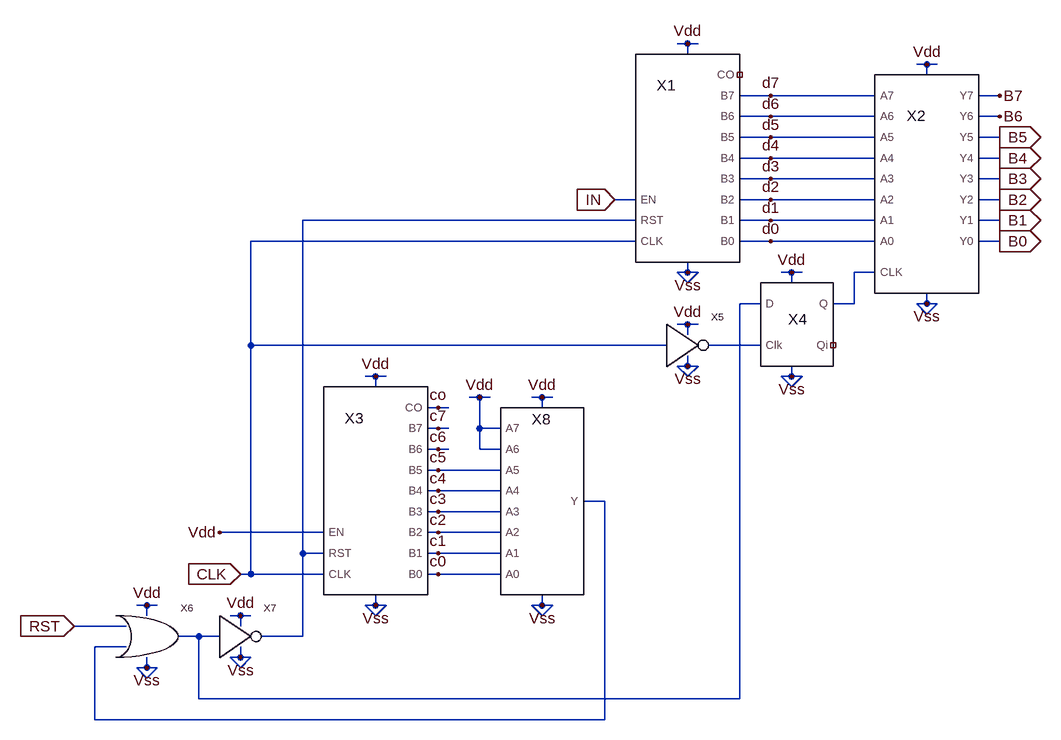
[diagram p0: schematic 6bit_acc_dump.asc]
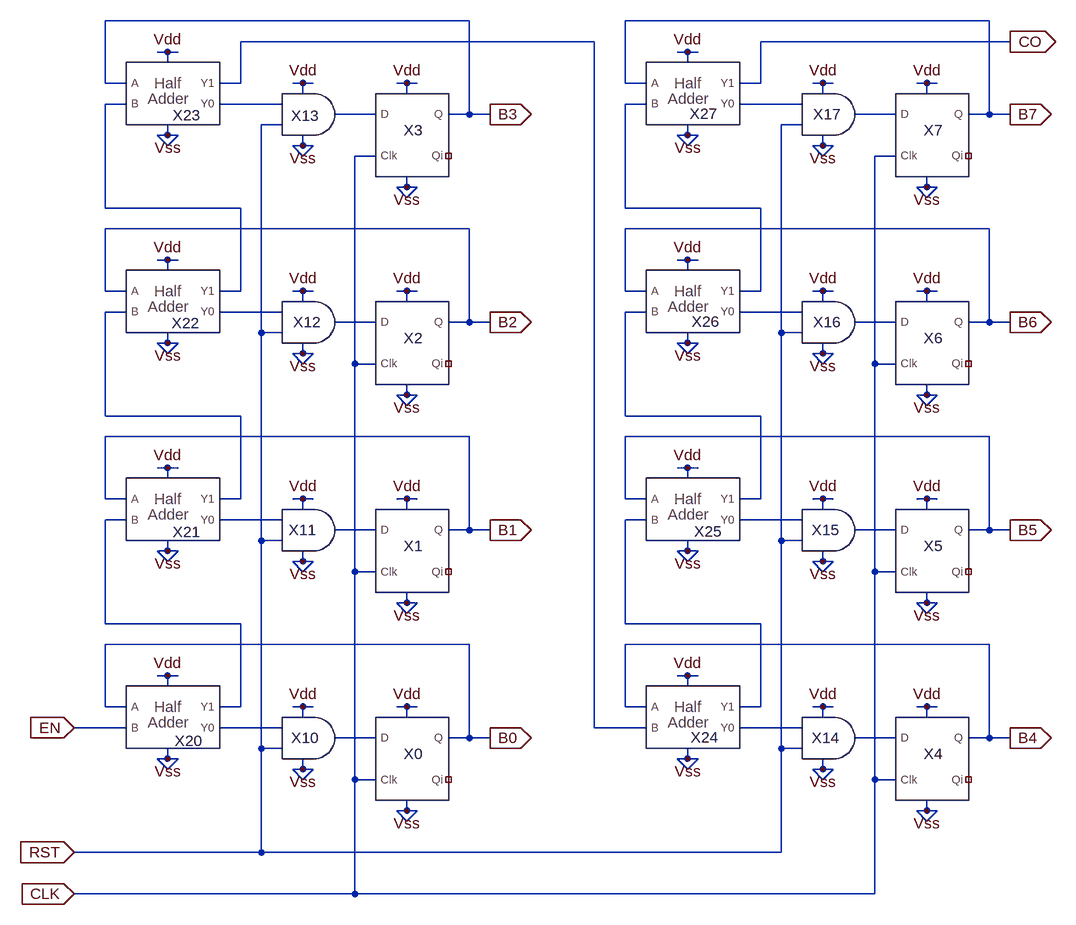
[diagram p1: sub-circuit 8bitcounter.asc]
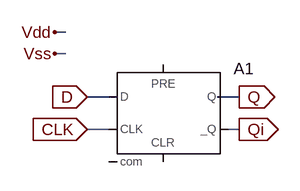
[diagram p2: sub-circuit dff.asc]
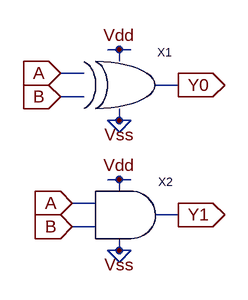
[diagram p3: sub-circuit halfadder.asc]
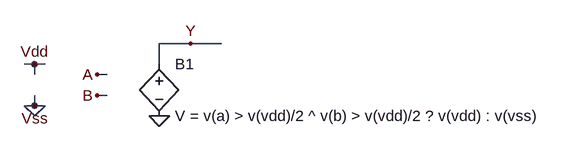
[diagram p4: sub-circuit xor.asc]
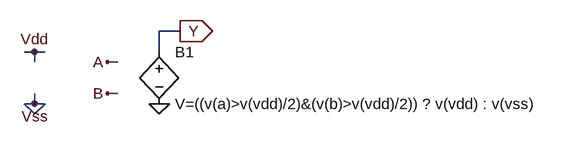
[diagram p5: sub-circuit and.asc]
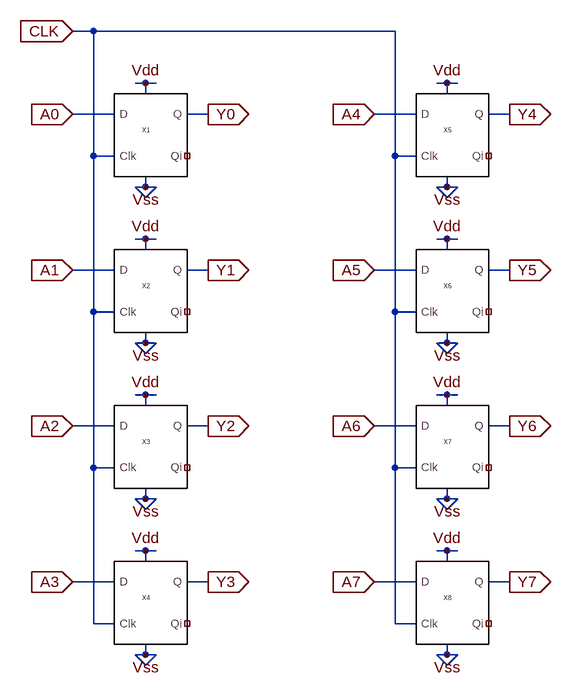
[diagram p6: sub-circuit 8bitreg.asc]
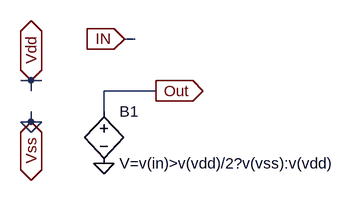
[diagram p7: sub-circuit inv.asc]
6bit_acc_dump.asc, the LTspice schematic file:
Version 4
SHEET 1 1020 1092
WIRE 448 -16 432 -16
WIRE 464 -16 448 -16
WIRE 448 0 448 -16
WIRE 816 16 800 16
WIRE 832 16 816 16
WIRE 816 32 816 16
WIRE 576 64 528 64
WIRE 736 64 576 64
WIRE 928 64 896 64
WIRE 576 96 528 96
WIRE 736 96 576 96
WIRE 928 96 896 96
WIRE 576 128 528 128
WIRE 736 128 576 128
WIRE 928 128 896 128
WIRE 576 160 528 160
WIRE 736 160 576 160
WIRE 928 160 896 160
WIRE 576 192 528 192
WIRE 736 192 576 192
WIRE 928 192 896 192
WIRE 368 224 336 224
WIRE 576 224 528 224
WIRE 736 224 576 224
WIRE 928 224 896 224
WIRE 368 256 -144 256
WIRE 576 256 528 256
WIRE 736 256 576 256
WIRE 928 256 896 256
WIRE 368 288 -224 288
WIRE 576 288 528 288
WIRE 736 288 576 288
WIRE 928 288 896 288
WIRE 448 336 448 320
WIRE 448 336 432 336
WIRE 464 336 448 336
WIRE 608 336 592 336
WIRE 624 336 608 336
WIRE 736 336 704 336
WIRE 448 352 432 336
WIRE 448 352 464 336
WIRE 608 352 608 336
WIRE 560 384 528 384
WIRE 704 384 704 336
WIRE 704 384 672 384
WIRE 816 384 816 368
WIRE 816 384 800 384
WIRE 832 384 816 384
WIRE 816 400 800 384
WIRE 816 400 832 384
WIRE 448 416 432 416
WIRE 464 416 448 416
WIRE 448 432 448 416
WIRE -224 448 -224 288
WIRE 416 448 -224 448
WIRE 560 448 480 448
WIRE 448 480 448 464
WIRE 448 480 432 480
WIRE 464 480 448 480
WIRE -32 496 -48 496
WIRE -16 496 -32 496
WIRE 448 496 432 480
WIRE 448 496 464 480
WIRE 608 496 608 480
WIRE 608 496 592 496
WIRE 624 496 608 496
WIRE -32 512 -32 496
WIRE 608 512 592 496
WIRE 608 512 624 496
WIRE 128 528 112 528
WIRE 144 528 128 528
WIRE 224 528 208 528
WIRE 240 528 224 528
WIRE 64 544 48 544
WIRE 80 544 64 544
WIRE 224 544 224 528
WIRE 64 576 48 576
WIRE 80 576 64 576
WIRE 128 576 128 528
WIRE 160 576 128 576
WIRE 64 608 48 608
WIRE 80 608 64 608
WIRE 128 608 128 576
WIRE 160 608 128 608
WIRE 64 640 48 640
WIRE 160 640 64 640
WIRE 64 672 48 672
WIRE 160 672 64 672
WIRE 320 688 288 688
WIRE 64 704 48 704
WIRE 160 704 64 704
WIRE -112 736 -272 736
WIRE 64 736 48 736
WIRE 160 736 64 736
WIRE -144 768 -144 256
WIRE -112 768 -144 768
WIRE 64 768 48 768
WIRE 160 768 64 768
WIRE -224 800 -224 448
WIRE -224 800 -240 800
WIRE -112 800 -224 800
WIRE 64 800 48 800
WIRE 160 800 64 800
WIRE -384 848 -400 848
WIRE -368 848 -384 848
WIRE -32 848 -32 832
WIRE -32 848 -48 848
WIRE -16 848 -32 848
WIRE 224 848 224 832
WIRE 224 848 208 848
WIRE 240 848 224 848
WIRE -384 864 -384 848
WIRE -240 864 -256 864
WIRE -224 864 -240 864
WIRE -32 864 -48 848
WIRE -32 864 -16 848
WIRE 224 864 208 848
WIRE 224 864 240 848
WIRE -416 880 -496 880
WIRE -240 880 -240 864
WIRE -304 896 -336 896
WIRE -272 896 -304 896
WIRE -144 896 -144 768
WIRE -144 896 -208 896
WIRE -416 912 -464 912
WIRE -240 928 -240 912
WIRE -240 928 -256 928
WIRE -224 928 -240 928
WIRE -384 944 -384 928
WIRE -384 944 -400 944
WIRE -368 944 -384 944
WIRE -240 944 -256 928
WIRE -240 944 -224 928
WIRE -384 960 -400 944
WIRE -384 960 -368 944
WIRE -304 992 -304 896
WIRE 528 992 528 384
WIRE 528 992 -304 992
WIRE -464 1024 -464 912
WIRE 320 1024 320 688
WIRE 320 1024 -464 1024
FLAG 448 -16 Vdd
FLAG 448 336 Vss
FLAG 816 16 Vdd
FLAG 816 384 Vss
FLAG 928 288 B0
IOPIN 928 288 Out
FLAG 928 256 B1
IOPIN 928 256 Out
FLAG 928 224 B2
IOPIN 928 224 Out
FLAG 928 192 B3
IOPIN 928 192 Out
FLAG 928 160 B4
IOPIN 928 160 Out
FLAG 928 128 B5
IOPIN 928 128 Out
FLAG 928 96 B6
FLAG 928 64 B7
FLAG 336 224 IN
IOPIN 336 224 In
FLAG -32 496 Vdd
FLAG -32 848 Vss
FLAG -240 800 CLK
IOPIN -240 800 In
FLAG -272 736 Vdd
FLAG 448 416 Vdd
FLAG 448 480 Vss
FLAG 608 336 Vdd
FLAG 608 496 Vss
FLAG -384 848 Vdd
FLAG -384 944 Vss
FLAG -240 864 Vdd
FLAG -240 928 Vss
FLAG -496 880 RST
IOPIN -496 880 In
FLAG 64 800 c0
FLAG 64 768 c1
FLAG 64 736 c2
FLAG 64 704 c3
FLAG 64 672 c4
FLAG 64 640 c5
FLAG 64 608 c6
FLAG 64 576 c7
FLAG 576 288 d0
FLAG 576 256 d1
FLAG 576 224 d2
FLAG 576 192 d3
FLAG 576 160 d4
FLAG 576 128 d5
FLAG 576 96 d6
FLAG 576 64 d7
FLAG 64 544 co
FLAG 224 528 Vdd
FLAG 224 848 Vss
FLAG 128 528 Vdd
SYMBOL 8bitcounter 448 192 R0
WINDOW 1 -16 16 VLeft 0
WINDOW 0 -48 -144 Left 0
SYMATTR InstName X1
SYMBOL 8bitreg 736 368 R0
SYMATTR InstName X2
SYMBOL 8bitcounter -32 704 R0
WINDOW 1 -16 16 VLeft 0
WINDOW 0 -48 -144 Left 0
SYMATTR InstName X3
SYMBOL dff 560 480 R0
SYMATTR InstName X4
SYMBOL inv 416 480 R0
SYMATTR InstName X5
SYMBOL or -416 896 R0
SYMATTR InstName X6
SYMBOL inv -272 928 R0
SYMATTR InstName X7
SYMBOL and8 224 688 R0
SYMATTR InstName X8

8bitcounter.asc, the sub-circuit schematic file:
Version 4
SHEET 1 1380 680
WIRE 448 -960 -112 -960
WIRE 1248 -960 688 -960
WIRE 640 -928 96 -928
WIRE 1280 -928 896 -928
WIRE -16 -912 -32 -912
WIRE 0 -912 -16 -912
WIRE 784 -912 768 -912
WIRE 800 -912 784 -912
WIRE -16 -896 -16 -912
WIRE 784 -896 784 -912
WIRE -112 -864 -112 -960
WIRE -80 -864 -112 -864
WIRE 96 -864 96 -928
WIRE 96 -864 64 -864
WIRE 192 -864 176 -864
WIRE 208 -864 192 -864
WIRE 352 -864 336 -864
WIRE 368 -864 352 -864
WIRE 688 -864 688 -960
WIRE 720 -864 688 -864
WIRE 896 -864 896 -928
WIRE 896 -864 864 -864
WIRE 992 -864 976 -864
WIRE 1008 -864 992 -864
WIRE 1152 -864 1136 -864
WIRE 1168 -864 1152 -864
WIRE 192 -848 192 -864
WIRE 352 -848 352 -864
WIRE 992 -848 992 -864
WIRE 1152 -848 1152 -864
WIRE -80 -832 -112 -832
WIRE 160 -832 64 -832
WIRE 720 -832 688 -832
WIRE 960 -832 864 -832
WIRE 304 -816 240 -816
WIRE 448 -816 448 -960
WIRE 448 -816 416 -816
WIRE 480 -816 448 -816
WIRE 1104 -816 1040 -816
WIRE 1248 -816 1248 -960
WIRE 1248 -816 1216 -816
WIRE 1280 -816 1248 -816
WIRE 160 -800 128 -800
WIRE 960 -800 928 -800
WIRE -16 -784 -16 -800
WIRE -16 -784 -32 -784
WIRE 0 -784 -16 -784
WIRE 784 -784 784 -800
WIRE 784 -784 768 -784
WIRE 800 -784 784 -784
WIRE -16 -768 -32 -784
WIRE -16 -768 0 -784
WIRE 192 -768 192 -784
WIRE 192 -768 176 -768
WIRE 208 -768 192 -768
WIRE 784 -768 768 -784
WIRE 784 -768 800 -784
WIRE 992 -768 992 -784
WIRE 992 -768 976 -768
WIRE 1008 -768 992 -768
WIRE 192 -752 176 -768
WIRE 192 -752 208 -768
WIRE 304 -752 272 -752
WIRE 992 -752 976 -768
WIRE 992 -752 1008 -768
WIRE 1104 -752 1072 -752
WIRE 352 -704 352 -720
WIRE 352 -704 336 -704
WIRE 368 -704 352 -704
WIRE 1152 -704 1152 -720
WIRE 1152 -704 1136 -704
WIRE 1168 -704 1152 -704
WIRE 352 -688 336 -704
WIRE 352 -688 368 -704
WIRE 1152 -688 1136 -704
WIRE 1152 -688 1168 -704
WIRE -112 -672 -112 -832
WIRE 96 -672 -112 -672
WIRE 688 -672 688 -832
WIRE 896 -672 688 -672
WIRE 448 -640 -112 -640
WIRE 1248 -640 688 -640
WIRE -16 -592 -32 -592
WIRE 0 -592 -16 -592
WIRE 784 -592 768 -592
WIRE 800 -592 784 -592
WIRE -16 -576 -16 -592
WIRE 784 -576 784 -592
WIRE -112 -544 -112 -640
WIRE -80 -544 -112 -544
WIRE 96 -544 96 -672
WIRE 96 -544 64 -544
WIRE 192 -544 176 -544
WIRE 208 -544 192 -544
WIRE 352 -544 336 -544
WIRE 368 -544 352 -544
WIRE 688 -544 688 -640
WIRE 720 -544 688 -544
WIRE 896 -544 896 -672
WIRE 896 -544 864 -544
WIRE 992 -544 976 -544
WIRE 1008 -544 992 -544
WIRE 1152 -544 1136 -544
WIRE 1168 -544 1152 -544
WIRE 192 -528 192 -544
WIRE 352 -528 352 -544
WIRE 992 -528 992 -544
WIRE 1152 -528 1152 -544
WIRE -80 -512 -112 -512
WIRE 160 -512 64 -512
WIRE 720 -512 688 -512
WIRE 960 -512 864 -512
WIRE 304 -496 240 -496
WIRE 448 -496 448 -640
WIRE 448 -496 416 -496
WIRE 480 -496 448 -496
WIRE 1104 -496 1040 -496
WIRE 1248 -496 1248 -640
WIRE 1248 -496 1216 -496
WIRE 1280 -496 1248 -496
WIRE 128 -480 128 -800
WIRE 160 -480 128 -480
WIRE 928 -480 928 -800
WIRE 960 -480 928 -480
WIRE -16 -464 -16 -480
WIRE -16 -464 -32 -464
WIRE 0 -464 -16 -464
WIRE 784 -464 784 -480
WIRE 784 -464 768 -464
WIRE 800 -464 784 -464
WIRE -16 -448 -32 -464
WIRE -16 -448 0 -464
WIRE 192 -448 192 -464
WIRE 192 -448 176 -448
WIRE 208 -448 192 -448
WIRE 784 -448 768 -464
WIRE 784 -448 800 -464
WIRE 992 -448 992 -464
WIRE 992 -448 976 -448
WIRE 1008 -448 992 -448
WIRE 192 -432 176 -448
WIRE 192 -432 208 -448
WIRE 272 -432 272 -752
WIRE 304 -432 272 -432
WIRE 992 -432 976 -448
WIRE 992 -432 1008 -448
WIRE 1072 -432 1072 -752
WIRE 1104 -432 1072 -432
WIRE 352 -384 352 -400
WIRE 352 -384 336 -384
WIRE 368 -384 352 -384
WIRE 1152 -384 1152 -400
WIRE 1152 -384 1136 -384
WIRE 1168 -384 1152 -384
WIRE 352 -368 336 -384
WIRE 352 -368 368 -384
WIRE 1152 -368 1136 -384
WIRE 1152 -368 1168 -384
WIRE -112 -352 -112 -512
WIRE 96 -352 -112 -352
WIRE 688 -352 688 -512
WIRE 896 -352 688 -352
WIRE 448 -320 -112 -320
WIRE 1248 -320 688 -320
WIRE -16 -272 -32 -272
WIRE 0 -272 -16 -272
WIRE 784 -272 768 -272
WIRE 800 -272 784 -272
WIRE -16 -256 -16 -272
WIRE 784 -256 784 -272
WIRE -112 -224 -112 -320
WIRE -80 -224 -112 -224
WIRE 96 -224 96 -352
WIRE 96 -224 64 -224
WIRE 192 -224 176 -224
WIRE 208 -224 192 -224
WIRE 352 -224 336 -224
WIRE 368 -224 352 -224
WIRE 688 -224 688 -320
WIRE 720 -224 688 -224
WIRE 896 -224 896 -352
WIRE 896 -224 864 -224
WIRE 992 -224 976 -224
WIRE 1008 -224 992 -224
WIRE 1152 -224 1136 -224
WIRE 1168 -224 1152 -224
WIRE 192 -208 192 -224
WIRE 352 -208 352 -224
WIRE 992 -208 992 -224
WIRE 1152 -208 1152 -224
WIRE -80 -192 -112 -192
WIRE 160 -192 64 -192
WIRE 720 -192 688 -192
WIRE 960 -192 864 -192
WIRE 304 -176 240 -176
WIRE 448 -176 448 -320
WIRE 448 -176 416 -176
WIRE 480 -176 448 -176
WIRE 1104 -176 1040 -176
WIRE 1248 -176 1248 -320
WIRE 1248 -176 1216 -176
WIRE 1280 -176 1248 -176
WIRE 128 -160 128 -480
WIRE 160 -160 128 -160
WIRE 928 -160 928 -480
WIRE 960 -160 928 -160
WIRE -16 -144 -16 -160
WIRE -16 -144 -32 -144
WIRE 0 -144 -16 -144
WIRE 784 -144 784 -160
WIRE 784 -144 768 -144
WIRE 800 -144 784 -144
WIRE -16 -128 -32 -144
WIRE -16 -128 0 -144
WIRE 192 -128 192 -144
WIRE 192 -128 176 -128
WIRE 208 -128 192 -128
WIRE 784 -128 768 -144
WIRE 784 -128 800 -144
WIRE 992 -128 992 -144
WIRE 992 -128 976 -128
WIRE 1008 -128 992 -128
WIRE 192 -112 176 -128
WIRE 192 -112 208 -128
WIRE 272 -112 272 -432
WIRE 304 -112 272 -112
WIRE 992 -112 976 -128
WIRE 992 -112 1008 -128
WIRE 1072 -112 1072 -432
WIRE 1104 -112 1072 -112
WIRE 352 -64 352 -80
WIRE 352 -64 336 -64
WIRE 368 -64 352 -64
WIRE 1152 -64 1152 -80
WIRE 1152 -64 1136 -64
WIRE 1168 -64 1152 -64
WIRE 352 -48 336 -64
WIRE 352 -48 368 -64
WIRE 1152 -48 1136 -64
WIRE 1152 -48 1168 -64
WIRE -112 -32 -112 -192
WIRE 96 -32 -112 -32
WIRE 688 -32 688 -192
WIRE 896 -32 688 -32
WIRE 448 0 -112 0
WIRE 1248 0 688 0
WIRE -16 48 -32 48
WIRE 0 48 -16 48
WIRE 784 48 768 48
WIRE 800 48 784 48
WIRE -16 64 -16 48
WIRE 784 64 784 48
WIRE -112 96 -112 0
WIRE -80 96 -112 96
WIRE 96 96 96 -32
WIRE 96 96 64 96
WIRE 192 96 176 96
WIRE 208 96 192 96
WIRE 352 96 336 96
WIRE 368 96 352 96
WIRE 688 96 688 0
WIRE 720 96 688 96
WIRE 896 96 896 -32
WIRE 896 96 864 96
WIRE 992 96 976 96
WIRE 1008 96 992 96
WIRE 1152 96 1136 96
WIRE 1168 96 1152 96
WIRE 192 112 192 96
WIRE 352 112 352 96
WIRE 992 112 992 96
WIRE 1152 112 1152 96
WIRE -80 128 -160 128
WIRE 160 128 64 128
WIRE 640 128 640 -928
WIRE 720 128 640 128
WIRE 960 128 864 128
WIRE 304 144 240 144
WIRE 448 144 448 0
WIRE 448 144 416 144
WIRE 480 144 448 144
WIRE 1104 144 1040 144
WIRE 1248 144 1248 0
WIRE 1248 144 1216 144
WIRE 1280 144 1248 144
WIRE 128 160 128 -160
WIRE 160 160 128 160
WIRE 928 160 928 -160
WIRE 960 160 928 160
WIRE -16 176 -16 160
WIRE -16 176 -32 176
WIRE 0 176 -16 176
WIRE 784 176 784 160
WIRE 784 176 768 176
WIRE 800 176 784 176
WIRE -16 192 -32 176
WIRE -16 192 0 176
WIRE 192 192 192 176
WIRE 192 192 176 192
WIRE 208 192 192 192
WIRE 784 192 768 176
WIRE 784 192 800 176
WIRE 992 192 992 176
WIRE 992 192 976 192
WIRE 1008 192 992 192
WIRE 192 208 176 192
WIRE 192 208 208 192
WIRE 272 208 272 -112
WIRE 304 208 272 208
WIRE 992 208 976 192
WIRE 992 208 1008 192
WIRE 1072 208 1072 -112
WIRE 1104 208 1072 208
WIRE 352 256 352 240
WIRE 352 256 336 256
WIRE 368 256 352 256
WIRE 1152 256 1152 240
WIRE 1152 256 1136 256
WIRE 1168 256 1152 256
WIRE 352 272 336 256
WIRE 352 272 368 256
WIRE 1152 272 1136 256
WIRE 1152 272 1168 256
WIRE 128 320 128 160
WIRE 128 320 -160 320
WIRE 928 320 928 160
WIRE 928 320 128 320
WIRE 272 384 272 208
WIRE 272 384 -160 384
WIRE 1072 384 1072 208
WIRE 1072 384 272 384
FLAG 352 96 Vdd
FLAG 352 256 Vss
FLAG 192 96 Vdd
FLAG -16 48 Vdd
FLAG 192 192 Vss
FLAG -16 176 Vss
FLAG 480 144 B0
IOPIN 480 144 Out
FLAG 352 -224 Vdd
FLAG 352 -64 Vss
FLAG 192 -224 Vdd
FLAG -16 -272 Vdd
FLAG 192 -128 Vss
FLAG -16 -144 Vss
FLAG 480 -176 B1
IOPIN 480 -176 Out
FLAG 352 -544 Vdd
FLAG 352 -384 Vss
FLAG 192 -544 Vdd
FLAG -16 -592 Vdd
FLAG 192 -448 Vss
FLAG -16 -464 Vss
FLAG 480 -496 B2
IOPIN 480 -496 Out
FLAG 352 -864 Vdd
FLAG 352 -704 Vss
FLAG 192 -864 Vdd
FLAG -16 -912 Vdd
FLAG 192 -768 Vss
FLAG -16 -784 Vss
FLAG 480 -816 B3
IOPIN 480 -816 Out
FLAG -160 128 EN
IOPIN -160 128 In
FLAG -160 320 RST
IOPIN -160 320 In
FLAG -160 384 CLK
IOPIN -160 384 In
FLAG 1152 96 Vdd
FLAG 1152 256 Vss
FLAG 992 96 Vdd
FLAG 784 48 Vdd
FLAG 992 192 Vss
FLAG 784 176 Vss
FLAG 1280 144 B4
IOPIN 1280 144 Out
FLAG 1152 -224 Vdd
FLAG 1152 -64 Vss
FLAG 992 -224 Vdd
FLAG 784 -272 Vdd
FLAG 992 -128 Vss
FLAG 784 -144 Vss
FLAG 1280 -176 B5
IOPIN 1280 -176 Out
FLAG 1152 -544 Vdd
FLAG 1152 -384 Vss
FLAG 992 -544 Vdd
FLAG 784 -592 Vdd
FLAG 992 -448 Vss
FLAG 784 -464 Vss
FLAG 1280 -496 B6
IOPIN 1280 -496 Out
FLAG 1152 -864 Vdd
FLAG 1152 -704 Vss
FLAG 992 -864 Vdd
FLAG 784 -912 Vdd
FLAG 992 -768 Vss
FLAG 784 -784 Vss
FLAG 1280 -816 B7
IOPIN 1280 -816 Out
FLAG 1280 -928 CO
IOPIN 1280 -928 Out
SYMBOL dff 304 240 R0
SYMATTR InstName X0
SYMBOL halfadder -80 160 R0
WINDOW 0 75 -12 Left 0
SYMATTR InstName X20
SYMBOL and 160 144 R0
WINDOW 0 14 0 Left 0
SYMATTR InstName X10
SYMBOL dff 304 -80 R0
SYMATTR InstName X1
SYMBOL halfadder -80 -160 R0
WINDOW 0 72 -13 Left 0
SYMATTR InstName X21
SYMBOL and 160 -176 R0
WINDOW 0 10 0 Left 0
SYMATTR InstName X11
SYMBOL dff 304 -400 R0
SYMATTR InstName X2
SYMBOL halfadder -80 -480 R0
WINDOW 0 70 -15 Left 0
SYMATTR InstName X22
SYMBOL and 160 -496 R0
WINDOW 0 17 0 Left 0
SYMATTR InstName X12
SYMBOL dff 304 -720 R0
SYMATTR InstName X3
SYMBOL halfadder -80 -800 R0
WINDOW 0 72 -15 Left 0
SYMATTR InstName X23
SYMBOL and 160 -816 R0
WINDOW 0 14 2 Left 0
SYMATTR InstName X13
SYMBOL dff 1104 240 R0
SYMATTR InstName X4
SYMBOL halfadder 720 160 R0
WINDOW 0 69 -17 Left 0
SYMATTR InstName X24
SYMBOL and 960 144 R0
WINDOW 0 15 0 Left 0
SYMATTR InstName X14
SYMBOL dff 1104 -80 R0
SYMATTR InstName X5
SYMBOL halfadder 720 -160 R0
WINDOW 0 74 -14 Left 0
SYMATTR InstName X25
SYMBOL and 960 -176 R0
WINDOW 0 15 0 Left 0
SYMATTR InstName X15
SYMBOL dff 1104 -400 R0
SYMATTR InstName X6
SYMBOL halfadder 720 -480 R0
WINDOW 0 70 -17 Left 0
SYMATTR InstName X26
SYMBOL and 960 -496 R0
WINDOW 0 17 0 Left 0
SYMATTR InstName X16
SYMBOL dff 1104 -720 R0
SYMATTR InstName X7
SYMBOL halfadder 720 -800 R0
WINDOW 0 67 -17 Left 0
SYMATTR InstName X27
SYMBOL and 960 -816 R0
WINDOW 0 17 0 Left 0
SYMATTR InstName X17

dff.asc, the sub-circuit schematic file:
Version 4
SHEET 1 880 680
WIRE 64 32 48 32
WIRE 64 64 48 64
WIRE 128 128 96 128
WIRE 320 128 288 128
WIRE 128 176 96 176
WIRE 320 176 304 176
FLAG 96 128 D
IOPIN 96 128 In
FLAG 96 176 CLK
IOPIN 96 176 In
FLAG 320 128 Q
IOPIN 320 128 Out
FLAG 320 176 Qi
IOPIN 320 176 Out
FLAG 48 32 Vdd
FLAG 48 64 Vss
SYMBOL Digital\\dflop 208 80 R0
SYMATTR InstName A1
SYMATTR SpiceLine vhigh=5 tau=1n

halfadder.asc, the sub-circuit schematic file:
Version 4
SHEET 1 880 680
WIRE 96 240 80 240
WIRE 112 240 96 240
WIRE 96 256 96 240
WIRE 48 272 16 272
WIRE 176 288 144 288
WIRE 48 304 16 304
WIRE 96 336 96 320
WIRE 96 336 80 336
WIRE 112 336 96 336
WIRE 96 352 80 336
WIRE 96 352 112 336
WIRE 96 416 80 416
WIRE 112 416 96 416
WIRE 96 432 96 416
WIRE 64 448 32 448
WIRE 176 464 144 464
WIRE 64 480 32 480
WIRE 96 512 96 496
WIRE 96 512 80 512
WIRE 112 512 96 512
WIRE 96 528 80 512
WIRE 96 528 112 512
FLAG 16 272 A
IOPIN 16 272 In
FLAG 16 304 B
IOPIN 16 304 In
FLAG 176 288 Y0
IOPIN 176 288 Out
FLAG 96 240 Vdd
FLAG 96 336 Vss
FLAG 96 416 Vdd
FLAG 96 512 Vss
FLAG 32 448 A
IOPIN 32 448 In
FLAG 32 480 B
IOPIN 32 480 In
FLAG 176 464 Y1
IOPIN 176 464 Out
SYMBOL xor 48 288 R0
SYMATTR InstName X1
SYMBOL and 64 464 R0
SYMATTR InstName X2

xor.asc, the sub-circuit schematic file:
Version 4
SHEET 1 1264 952
WIRE 592 448 544 448
WIRE 640 448 592 448
WIRE 352 480 336 480
WIRE 368 480 352 480
WIRE 544 480 544 448
WIRE 352 496 352 480
WIRE 464 496 448 496
WIRE 464 528 448 528
WIRE 352 544 352 528
WIRE 352 544 336 544
WIRE 368 544 352 544
WIRE 352 560 336 544
WIRE 352 560 368 544
FLAG 448 496 A
FLAG 448 528 B
FLAG 352 480 Vdd
FLAG 352 544 Vss
FLAG 544 560 0
FLAG 592 448 Y
SYMBOL bv 544 464 R0
SYMATTR InstName B1
SYMATTR Value V = v(a) > v(vdd)/2 ^ v(b) > v(vdd)/2 ? v(vdd) : v(vss)

and.asc, the sub-circuit schematic file:
Version 4
SHEET 1 1192 680
WIRE 560 80 528 80
WIRE 336 112 320 112
WIRE 352 112 336 112
WIRE 528 112 528 80
WIRE 336 128 336 112
WIRE 464 128 448 128
WIRE 464 176 448 176
WIRE 336 192 336 176
WIRE 336 192 320 192
WIRE 352 192 336 192
WIRE 336 208 320 192
WIRE 336 208 352 192
FLAG 448 128 A
FLAG 448 176 B
FLAG 336 112 Vdd
FLAG 560 80 Y
IOPIN 560 80 Out
FLAG 336 192 Vss
FLAG 528 192 0
SYMBOL bv 528 96 R0
SYMATTR InstName B1
SYMATTR Value V=((v(a)>v(vdd)/2)&(v(b)>v(vdd)/2)) ? v(vdd) : v(vss)

8bitreg.asc, the sub-circuit schematic file:
Version 4
SHEET 1 880 1012
WIRE -192 -224 -224 -224
WIRE 272 -224 -192 -224
WIRE -112 -144 -128 -144
WIRE -96 -144 -112 -144
WIRE 352 -144 336 -144
WIRE 368 -144 352 -144
WIRE -112 -128 -112 -144
WIRE 352 -128 352 -144
WIRE -160 -96 -224 -96
WIRE -16 -96 -48 -96
WIRE 304 -96 240 -96
WIRE 448 -96 416 -96
WIRE -192 -32 -192 -224
WIRE -160 -32 -192 -32
WIRE 272 -32 272 -224
WIRE 304 -32 272 -32
WIRE -112 16 -112 0
WIRE -112 16 -128 16
WIRE -96 16 -112 16
WIRE 352 16 352 0
WIRE 352 16 336 16
WIRE 368 16 352 16
WIRE -112 32 -128 16
WIRE -112 32 -96 16
WIRE 352 32 336 16
WIRE 352 32 368 16
WIRE -112 96 -128 96
WIRE -96 96 -112 96
WIRE 352 96 336 96
WIRE 368 96 352 96
WIRE -112 112 -112 96
WIRE 352 112 352 96
WIRE -160 144 -224 144
WIRE -16 144 -48 144
WIRE 304 144 240 144
WIRE 448 144 416 144
WIRE -192 208 -192 -32
WIRE -160 208 -192 208
WIRE 272 208 272 -32
WIRE 304 208 272 208
WIRE -112 256 -112 240
WIRE -112 256 -128 256
WIRE -96 256 -112 256
WIRE 352 256 352 240
WIRE 352 256 336 256
WIRE 368 256 352 256
WIRE -112 272 -128 256
WIRE -112 272 -96 256
WIRE 352 272 336 256
WIRE 352 272 368 256
WIRE -112 336 -128 336
WIRE -96 336 -112 336
WIRE 352 336 336 336
WIRE 368 336 352 336
WIRE -112 352 -112 336
WIRE 352 352 352 336
WIRE -160 384 -224 384
WIRE -16 384 -48 384
WIRE 304 384 240 384
WIRE 448 384 416 384
WIRE -192 448 -192 208
WIRE -160 448 -192 448
WIRE 272 448 272 208
WIRE 304 448 272 448
WIRE -112 496 -112 480
WIRE -112 496 -128 496
WIRE -96 496 -112 496
WIRE 352 496 352 480
WIRE 352 496 336 496
WIRE 368 496 352 496
WIRE -112 512 -128 496
WIRE -112 512 -96 496
WIRE 352 512 336 496
WIRE 352 512 368 496
WIRE -112 576 -128 576
WIRE -96 576 -112 576
WIRE 352 576 336 576
WIRE 368 576 352 576
WIRE -112 592 -112 576
WIRE 352 592 352 576
WIRE -160 624 -224 624
WIRE -16 624 -48 624
WIRE 304 624 240 624
WIRE 448 624 416 624
WIRE -192 688 -192 448
WIRE -160 688 -192 688
WIRE 272 688 272 448
WIRE 304 688 272 688
WIRE -112 736 -112 720
WIRE -112 736 -128 736
WIRE -96 736 -112 736
WIRE 352 736 352 720
WIRE 352 736 336 736
WIRE 368 736 352 736
WIRE -112 752 -128 736
WIRE -112 752 -96 736
WIRE 352 752 336 736
WIRE 352 752 368 736
FLAG -112 -144 Vdd
FLAG -112 16 Vss
FLAG -224 -96 A0
IOPIN -224 -96 In
FLAG -16 -96 Y0
IOPIN -16 -96 Out
FLAG -112 96 Vdd
FLAG -112 256 Vss
FLAG -224 144 A1
IOPIN -224 144 In
FLAG -16 144 Y1
IOPIN -16 144 Out
FLAG -112 336 Vdd
FLAG -112 496 Vss
FLAG -224 384 A2
IOPIN -224 384 In
FLAG -16 384 Y2
IOPIN -16 384 Out
FLAG -112 576 Vdd
FLAG -112 736 Vss
FLAG -224 624 A3
IOPIN -224 624 In
FLAG -16 624 Y3
IOPIN -16 624 Out
FLAG -224 -224 CLK
IOPIN -224 -224 In
FLAG 352 -144 Vdd
FLAG 352 16 Vss
FLAG 240 -96 A4
IOPIN 240 -96 In
FLAG 448 -96 Y4
IOPIN 448 -96 Out
FLAG 352 96 Vdd
FLAG 352 256 Vss
FLAG 240 144 A5
IOPIN 240 144 In
FLAG 448 144 Y5
IOPIN 448 144 Out
FLAG 352 336 Vdd
FLAG 352 496 Vss
FLAG 240 384 A6
IOPIN 240 384 In
FLAG 448 384 Y6
IOPIN 448 384 Out
FLAG 352 576 Vdd
FLAG 352 736 Vss
FLAG 240 624 A7
IOPIN 240 624 In
FLAG 448 624 Y7
IOPIN 448 624 Out
SYMBOL dff -160 0 R0
SYMATTR InstName X1
SYMBOL dff -160 240 R0
SYMATTR InstName X2
SYMBOL dff -160 480 R0
SYMATTR InstName X3
SYMBOL dff -160 720 R0
SYMATTR InstName X4
SYMBOL dff 304 0 R0
SYMATTR InstName X5
SYMBOL dff 304 240 R0
SYMATTR InstName X6
SYMBOL dff 304 480 R0
SYMATTR InstName X7
SYMBOL dff 304 720 R0
SYMATTR InstName X8

inv.asc, the sub-circuit schematic file:
Version 4
SHEET 1 6308 700
WIRE 2144 -304 2128 -304
WIRE 1984 -240 1968 -240
WIRE 2000 -240 1984 -240
WIRE 1984 -224 1984 -240
WIRE 2176 -224 2096 -224
WIRE 2096 -192 2096 -224
WIRE 1984 -176 1984 -192
WIRE 1984 -176 1968 -176
WIRE 2000 -176 1984 -176
WIRE 1984 -160 1968 -176
WIRE 1984 -160 2000 -176
FLAG 1984 -240 Vdd
IOPIN 1984 -240 BiDir
FLAG 2176 -224 Out
IOPIN 2176 -224 Out
FLAG 1984 -176 Vss
IOPIN 1984 -176 BiDir
FLAG 2128 -304 IN
IOPIN 2128 -304 In
FLAG 2096 -112 0
SYMBOL bv 2096 -208 R0
SYMATTR InstName B1
SYMATTR Value V=v(in)>v(vdd)/2?v(vss):v(vdd)

or.asc, the sub-circuit schematic file:
Version 4
SHEET 1 1284 680
WIRE 656 0 640 0
WIRE 656 32 640 32
WIRE 656 112 624 112
WIRE 496 144 480 144
WIRE 512 144 496 144
WIRE 624 144 624 112
WIRE 496 160 496 144
WIRE 496 192 496 176
WIRE 496 192 480 192
WIRE 512 192 496 192
WIRE 496 208 480 192
WIRE 496 208 512 192
FLAG 656 112 Y
IOPIN 656 112 Out
FLAG 624 224 0
FLAG 640 0 A
IOPIN 640 0 In
FLAG 640 32 B
IOPIN 640 32 In
FLAG 496 144 Vdd
FLAG 496 192 Vss
SYMBOL bv 624 128 R0
SYMATTR InstName B1
SYMATTR Value V=v(a)>v(vdd)/2 | v(b)>v(vdd)/2 ? v(vdd) : v(vss)

and8.asc, the sub-circuit schematic file:
Version 4
SHEET 1 880 700
WIRE 144 80 128 80
WIRE 160 80 144 80
WIRE 144 96 144 80
WIRE 112 112 80 112
WIRE 224 128 192 128
WIRE 112 144 80 144
WIRE 288 160 272 160
WIRE 304 160 288 160
WIRE 144 176 144 160
WIRE 144 176 128 176
WIRE 160 176 144 176
WIRE 288 176 288 160
WIRE 144 192 128 176
WIRE 144 192 160 176
WIRE 224 192 224 128
WIRE 256 192 224 192
WIRE 368 208 336 208
WIRE 256 224 224 224
WIRE 144 240 128 240
WIRE 160 240 144 240
WIRE 144 256 144 240
WIRE 288 256 288 240
WIRE 288 256 272 256
WIRE 304 256 288 256
WIRE 112 272 80 272
WIRE 288 272 272 256
WIRE 288 272 304 256
WIRE 224 288 224 224
WIRE 224 288 192 288
WIRE 112 304 80 304
WIRE 432 320 416 320
WIRE 448 320 432 320
WIRE 144 336 144 320
WIRE 144 336 128 336
WIRE 160 336 144 336
WIRE 432 336 432 320
WIRE 144 352 128 336
WIRE 144 352 160 336
WIRE 368 352 368 208
WIRE 400 352 368 352
WIRE 512 368 480 368
WIRE 400 384 368 384
WIRE 144 400 128 400
WIRE 160 400 144 400
WIRE 144 416 144 400
WIRE 432 416 432 400
WIRE 432 416 416 416
WIRE 448 416 432 416
WIRE 112 432 80 432
WIRE 432 432 416 416
WIRE 432 432 448 416
WIRE 224 448 192 448
WIRE 112 464 80 464
WIRE 288 480 272 480
WIRE 304 480 288 480
WIRE 144 496 144 480
WIRE 144 496 128 496
WIRE 160 496 144 496
WIRE 288 496 288 480
WIRE 144 512 128 496
WIRE 144 512 160 496
WIRE 224 512 224 448
WIRE 256 512 224 512
WIRE 368 528 368 384
WIRE 368 528 336 528
WIRE 256 544 224 544
WIRE 144 560 128 560
WIRE 160 560 144 560
WIRE 144 576 144 560
WIRE 288 576 288 560
WIRE 288 576 272 576
WIRE 304 576 288 576
WIRE 112 592 80 592
WIRE 288 592 272 576
WIRE 288 592 304 576
WIRE 224 608 224 544
WIRE 224 608 192 608
WIRE 112 624 80 624
WIRE 144 656 144 640
WIRE 144 656 128 656
WIRE 160 656 144 656
WIRE 144 672 128 656
WIRE 144 672 160 656
FLAG 144 80 Vdd
FLAG 144 176 Vss
FLAG 144 240 Vdd
FLAG 144 336 Vss
FLAG 144 400 Vdd
FLAG 144 496 Vss
FLAG 144 560 Vdd
FLAG 144 656 Vss
FLAG 288 160 Vdd
FLAG 288 256 Vss
FLAG 288 480 Vdd
FLAG 288 576 Vss
FLAG 432 320 Vdd
FLAG 432 416 Vss
FLAG 80 624 A0
IOPIN 80 624 In
FLAG 80 592 A1
IOPIN 80 592 In
FLAG 80 464 A2
IOPIN 80 464 In
FLAG 80 432 A3
IOPIN 80 432 In
FLAG 80 304 A4
IOPIN 80 304 In
FLAG 80 272 A5
IOPIN 80 272 In
FLAG 80 144 A6
IOPIN 80 144 In
FLAG 80 112 A7
IOPIN 80 112 In
FLAG 512 368 Y
IOPIN 512 368 Out
SYMBOL and 112 128 R0
SYMATTR InstName X1
SYMBOL and 112 288 R0
SYMATTR InstName X2
SYMBOL and 112 448 R0
SYMATTR InstName X3
SYMBOL and 112 608 R0
SYMATTR InstName X4
SYMBOL and 256 208 R0
SYMATTR InstName X5
SYMBOL and 256 528 R0
SYMATTR InstName X6
SYMBOL and 400 368 R0
SYMATTR InstName X7

The netlist it stands for:
* 6bit_acc_dump.asc
XX1 Vdd Vss IN CLK N001 d0 d1 d2 d3 d4 d5 d6 d7 NC_01 8bitcounter
XX2 Vdd Vss N002 d0 d1 d2 d3 d4 d5 d6 d7 B0 B1 B2 B3 B4 B5 B6 B7 8bitreg
XX3 Vdd Vss Vdd CLK N001 c0 c1 c2 c3 c4 c5 c6 c7 co 8bitcounter
XX4 N003 N004 N002 NC_02 Vdd Vss dff
XX5 Vdd Vss CLK N004 inv
XX6 RST N005 N003 Vdd Vss or
XX7 Vdd Vss N003 N001 inv
XX8 Vdd Vss c0 c1 c2 c3 c4 c5 Vdd Vdd N005 and8

* block symbol definitions
.subckt 8bitcounter Vdd Vss EN CLK RST B0 B1 B2 B3 B4 B5 B6 B7 CO
XX0 N022 CLK B0 NC_01 Vdd Vss dff
XX20 B0 EN N020 N014 Vdd Vss halfadder
XX10 N020 RST N022 Vdd Vss and
XX1 N018 CLK B1 NC_02 Vdd Vss dff
XX21 B1 N014 N015 N008 Vdd Vss halfadder
XX11 N015 RST N018 Vdd Vss and
XX2 N012 CLK B2 NC_03 Vdd Vss dff
XX22 B2 N008 N009 N002 Vdd Vss halfadder
XX12 N009 RST N012 Vdd Vss and
XX3 N006 CLK B3 NC_04 Vdd Vss dff
XX23 B3 N002 N003 N001 Vdd Vss halfadder
XX13 N003 RST N006 Vdd Vss and
XX4 N023 CLK B4 NC_05 Vdd Vss dff
XX24 B4 N001 N021 N016 Vdd Vss halfadder
XX14 N021 RST N023 Vdd Vss and
XX5 N019 CLK B5 NC_06 Vdd Vss dff
XX25 B5 N016 N017 N010 Vdd Vss halfadder
XX15 N017 RST N019 Vdd Vss and
XX6 N013 CLK B6 NC_07 Vdd Vss dff
XX26 B6 N010 N011 N004 Vdd Vss halfadder
XX16 N011 RST N013 Vdd Vss and
XX7 N007 CLK B7 NC_08 Vdd Vss dff
XX27 B7 N004 N005 CO Vdd Vss halfadder
XX17 N005 RST N007 Vdd Vss and
.ends 8bitcounter

.subckt dff D Clk Q Qi VDD Vss
A1 D 0 CLK 0 0 Qi Q 0 DFLOP vhigh=5 tau=1n
.ends dff

.subckt halfadder A B Y0 Y1 Vdd Vss
XX1 A B Y0 Vdd Vss xor
XX2 A B Y1 Vdd Vss and
.ends halfadder

.subckt xor A B Y Vdd Vss
B1 Y 0 V = v(a) > v(vdd)/2 ^ v(b) > v(vdd)/2 ? v(vdd) : v(vss)
.ends xor

.subckt and A B Y Vdd Vss
B1 Y 0 V=((v(a)>v(vdd)/2)&(v(b)>v(vdd)/2)) ? v(vdd) : v(vss)
.ends and

.subckt 8bitreg Vdd Vss CLK A0 A1 A2 A3 A4 A5 A6 A7 Y0 Y1 Y2 Y3 Y4 Y5 Y6 Y7
XX1 A0 CLK Y0 NC_01 Vdd Vss dff
XX2 A1 CLK Y1 NC_02 Vdd Vss dff
XX3 A2 CLK Y2 NC_03 Vdd Vss dff
XX4 A3 CLK Y3 NC_04 Vdd Vss dff
XX5 A4 CLK Y4 NC_05 Vdd Vss dff
XX6 A5 CLK Y5 NC_06 Vdd Vss dff
XX7 A6 CLK Y6 NC_07 Vdd Vss dff
XX8 A7 CLK Y7 NC_08 Vdd Vss dff
.ends 8bitreg

.subckt inv Vdd Vss IN OUT
B1 Out 0 V=v(in)>v(vdd)/2?v(vss):v(vdd)
.ends inv

.subckt or A B Y Vdd Vss
B1 Y 0 V=v(a)>v(vdd)/2 | v(b)>v(vdd)/2 ? v(vdd) : v(vss)
.ends or

.subckt and8 Vdd Vss A0 A1 A2 A3 A4 A5 A6 A7 Y
XX1 A7 A6 N001 Vdd Vss and
XX2 A5 A4 N003 Vdd Vss and
XX3 A3 A2 N005 Vdd Vss and
XX4 A1 A0 N006 Vdd Vss and
XX5 N001 N003 N002 Vdd Vss and
XX6 N005 N006 N004 Vdd Vss and
XX7 N002 N004 Y Vdd Vss and
.ends and8

.backanno
.end